# EAGLE design WeatherWidget (EAGLE 9.5.0)
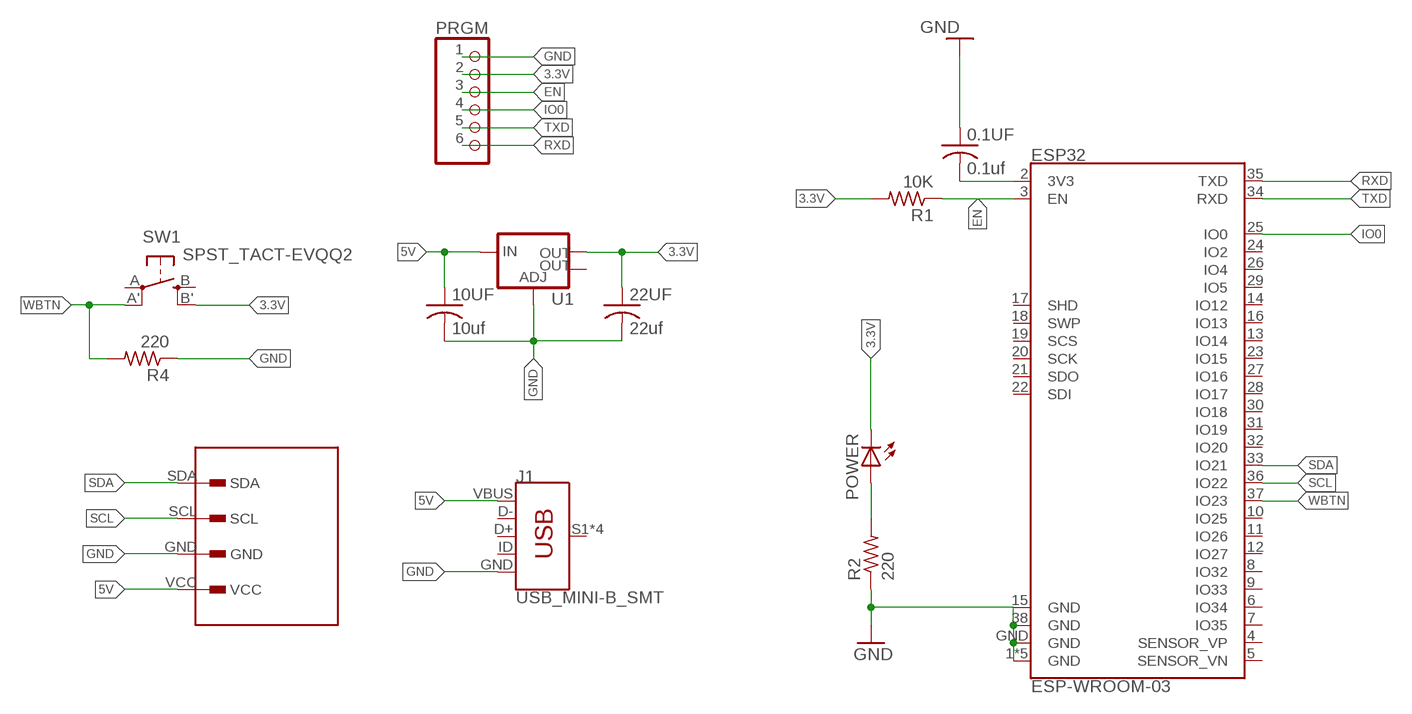
[diagram p0: schematic, sheet 1]

## Parts
0.1UF  0.1uf  C-USC0805K  [C0805K]
10UF  10uf  C-USC0805K  [C0805K]
22UF  22uf  C-USC0805K  [C0805K]
128X1  128X64OLED  [128X64OLED]
ESP32  ESP-WROOM-03  [ESP-WROOM-03-HOLES]
J1  USB_MINI-B_SMT  [USB-MINIB]
POWER  LEDCHIP-LED0805  [CHIP-LED0805]
PRGM  PINHD-1X6  [1X06]
R1  10K  R-US_R0805  [R0805]
R2  220  R-US_R0805  [R0805]
R4  220  R-US_R0805  [R0805]
SW1  SPST_TACT-EVQQ2  [EVQ-Q2]
U1  V_REG_LM1117SOT223  [SOT223]

## Nets
3.3V: 22UF.1 POWER.C PRGM.2 R1.2 SW1.B'(S1) U1.2(OUT)
5V: 10UF.1 128X1.VCC J1.VBUS U1.3(IN)
EN: ESP32.3(EN) PRGM.3 R1.1
GND: 0.1UF.1 10UF.2 22UF.2 128X1.GND ESP32.1(GND) ESP32.15(GND) ESP32.38(GND) ESP32.GND ESP32.GND1(GND) ESP32.GND2(GND) ESP32.GND3(GND) ESP32.GND4(GND) J1.GND PRGM.1 R2.1 R4.1 U1.1(ADJ)
IO0: ESP32.25(IO0) PRGM.4
N$1: POWER.A R2.2
N$2: 0.1UF.2 ESP32.2(3V3)
RXD: ESP32.35(TXD) PRGM.6
SCL: 128X1.SCL ESP32.36(IO22)
SDA: 128X1.SDA ESP32.33(IO21)
TXD: ESP32.34(RXD) PRGM.5
WBTN: ESP32.37(IO23) R4.2 SW1.A'(P1)
Unconnected: ESP32.4(SENSOR_VP) ESP32.5(SENSOR_VN) ESP32.6(IO34) ESP32.7(IO35) ESP32.8(IO32) ESP32.9(IO33) ESP32.10(IO25) ESP32.11(IO26) ESP32.12(IO27) ESP32.13(IO14) ESP32.14(IO12) ESP32.16(IO13) ESP32.17(SHD) ESP32.18(SWP) ESP32.19(SCS) ESP32.20(SCK) ESP32.21(SDO) ESP32.22(SDI) ESP32.23(IO15) ESP32.24(IO2) ESP32.26(IO4) ESP32.27(IO16) ESP32.28(IO17) ESP32.29(IO5) ESP32.30(IO18) ESP32.31(IO19) ESP32.32(IO20) J1.D+ J1.D- J1.ID J1.S1(SHIELD) J1.S2(SHIELD) J1.S3(SHIELD) J1.S4(SHIELD) SW1.A(P) SW1.B(S) U1.4(OUT)

## Library data of the parts
0.1UF 10UF 22UF = adafruit:C-US: CAPACITOR, American symbol
128X1 = 128x64oled:128X64OLED
ESP32 = bitcows-esp32:ESP-WROOM-03
J1 = SparkFun-Connectors:USB_MINI-B: USB type Mini-B Connector Breaks out 5th pin, and includes shield pins if needed. SparkFun Products: SparkFun FTDI Basic Breakout <https://www.sparkfun.com/products/9716> SparkFun XBee Explorer USB <https://www.sparkfun.com/products/11812> SparkFun Redboard <https://www.sparkfun.com/products/12757>; PROD_ID: CONN-08193; SF_ID: PRT-00587
POWER = adafruit:LED: LED OSRAM: - CHIPLED LG R971, LG N971, LY N971, LG Q971, LY Q971, LO R971, LY R971 LH N974, LH R974 LS Q976, LO Q976, LY Q976 LO Q996 - Hyper CHIPLED LW Q18S LB Q993, LB Q99A, LB R99A - SideLED LS A670, LO A670, LY A670, LG A670, LP A670 LB A673, LV A673, LT A673, LW A673 LH A674 LY A675 LS A676, LA A676, LO A676, LY A676, LW A676 LS A679, LY A679, LG A679 - Hyper Micro SIDELED® LS Y876, LA Y876, LO Y876, LY Y876 LT Y87S - SmartLED LW L88C, LW L88S LB L89C, LB L89S, LG L890 LS L89K, LO L89K, LY L89K LS L896, LA L896, LO L896, LY L896 - TOPLED LS T670, LO T670, LY T670, LG T670, LP T670 LSG T670, LSP T670, LSY T670, LOP T670, LYG T670 LG T671, LOG T671, LSG T671 LB T673, LV T673, LT T673, LW T673 LH T674 LS T676, LA T676, LO T676, LY T676, LB T676, LH T676, LSB T676, LW T676 LB T67C, LV T67C, LT T67C, LS T67K, LO T67K, LY T67K, LW E67C LS E67B, LA E67B, LO E67B, LY E67B, LB E67C, LV E67C, LT E67C LW T67C LS T679, LY T679, LG T679 LS T770, LO T770, LY T770, LG T770, LP T770 LB T773, LV T773, LT T773, LW T773 LH T774 LS E675, LA E675, LY E675, LS T675 LS T776, LA T776, LO T776, LY T776, LB T776 LHGB T686 LT T68C, LB T68C - Hyper Mini TOPLED® LB M676 - Mini TOPLED Santana® LG M470 LS M47K, LO M47K, LY M47K Source: http://www.osram.convergy.de/
PRGM = adafruit:PINHD-1X6: PIN HEADER
R1 R2 R4 = adafruit:R-US_: RESISTOR, American symbol
SW1 = adafruit:SPST_TACT: SMT 6mm switch, EVQQ2 series http://www.ladyada.net/library/eagle
U1 = SparkFun-IC-Power:V_REG_LM1117: Voltage Regulator LM1117 Standard adjustable voltage regulator but in SMD form. Spark Fun Electronics SKU : COM-00595; PROD_ID: VREG-08170

## Board
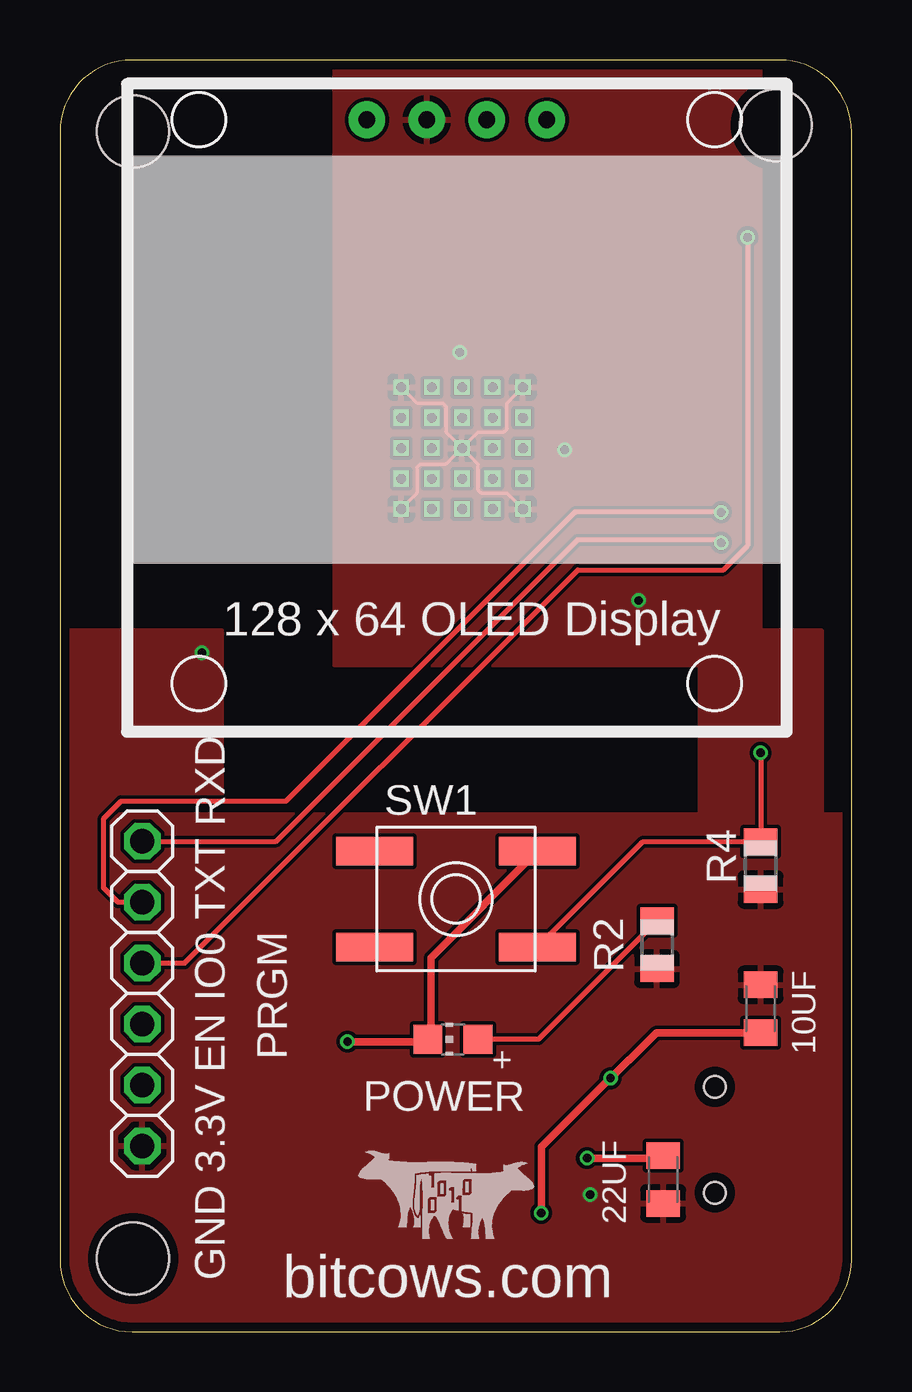
[diagram p1: board, top side]
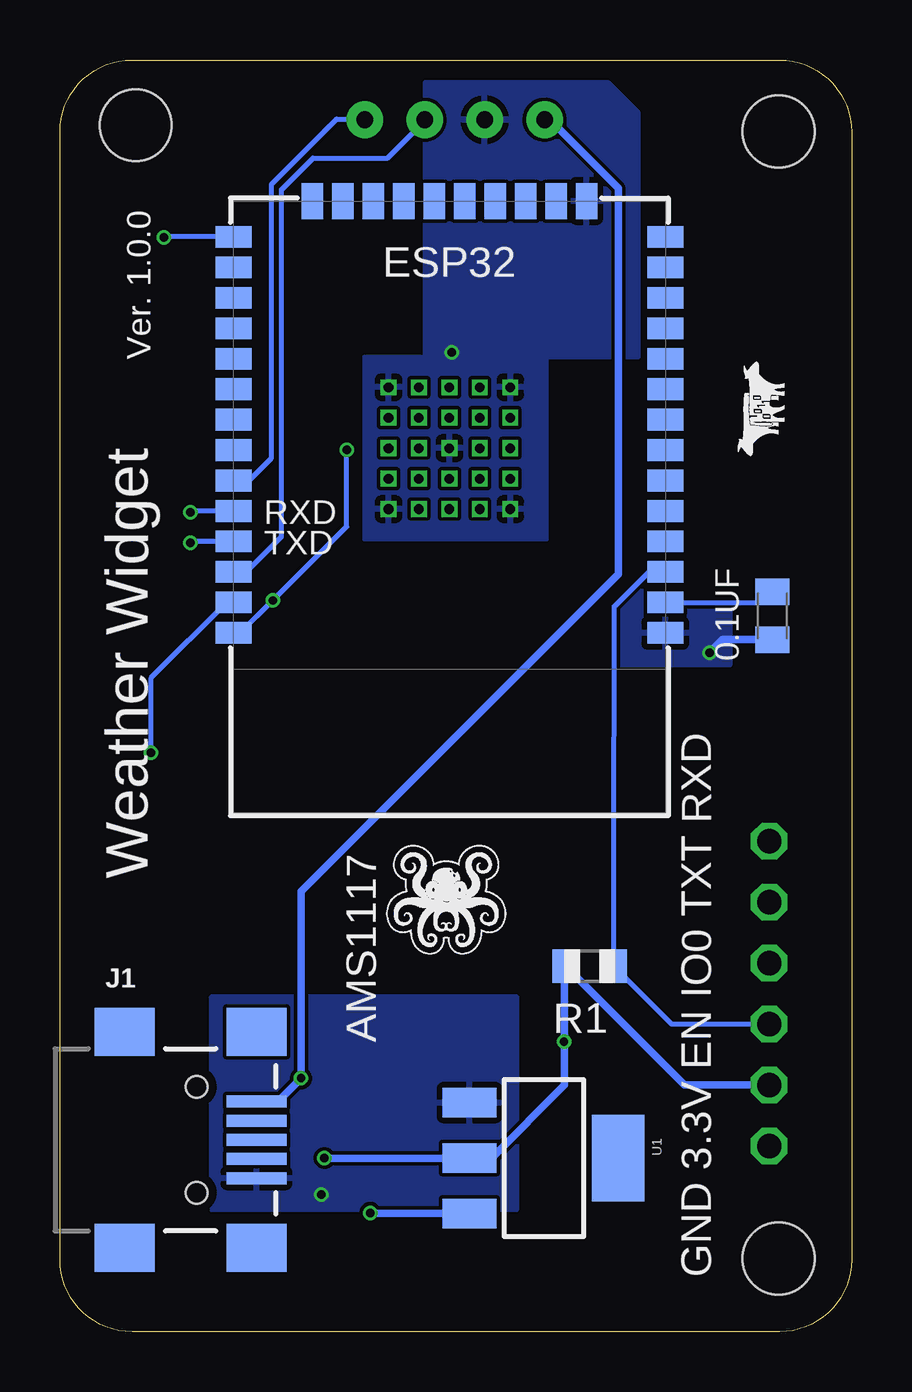
[diagram p2: board, bottom side, seen from below]

Size 33 x 53.01 mm. Coordinates in mm from the lower left corner, seen from the top.
Outline: 33,3 33,50.01 arc90 30,53.01 3,53.01 arc90 0,50.01 0,3 arc90 3,0 30,0 arc90 33,3
Copper layers (1*16): Top 0.035559375mm / dielectric 1.6mm / Bottom 0.035559375mm
Design rules "oshpark-2layer": minimum track width 6mil, minimum drill 10mil, track to track 6mil, track to pad 6mil, pad to pad 6mil, via to via 6mil, smd to smd 6mil, copper to edge 15mil, drill to drill 6mil, minimum pad ring 5mil, minimum via ring 5mil, stop-mask expansion 2.5mil, vias tented up to drill 0mil, thermal gap 10mil
Holes 3 mm at 3.05,50.04 29.84,50.29 3.05,3.05

### Footprints (pad centres in the part's own frame; a part is rotated, then mirrored left to right if it is on the bottom)
C0805K = smd 1.1 x 1.4: 1 -1,0; 2 1,0
128X64OLED = drill 0.7 pad 1.524: GND 12.5,25.5; SCL 15,25.5; SDA 17.5,25.5; VCC 10,25.5
ESP-WROOM-03-HOLES = smd 0.9 x 1.5: 1 7.7,9; 2 6.43,9; 3 5.16,9; 4 3.89,9; 5 2.62,9; 6 1.35,9; 7 0.08,9; 8 -1.19,9; 9 -2.46,9; 10 -3.73,9; 11 -5,9; 12 -6.27,9; 13 -7.54,9; 14 -8.81,9; 25 -8.81,-9; 26 -7.54,-9; 27 -6.27,-9; 28 -5,-9; 29 -3.73,-9; 30 -2.46,-9; 31 -1.19,-9; 32 0.08,-9; 33 1.35,-9; 34 2.62,-9; 35 3.89,-9; 36 5.16,-9; 37 6.43,-9; 38 7.7,-9 | smd 1.5 x 0.9: 15 -10.3,5.715; 16 -10.3,4.445; 17 -10.3,3.175; 18 -10.3,1.905; 19 -10.3,0.635; 20 -10.3,-0.635; 21 -10.3,-1.905; 22 -10.3,-3.175; 23 -10.3,-4.445; 24 -10.3,-5.715 | drill 0.4 square: GND -2.54,2.54; GND1 2.54,2.54; GND2 0,0; GND3 -2.54,-2.54; GND4 2.54,-2.54; P$2 -2.54,1.27; P$4 -2.54,-1.27; P$5 -2.54,0; P$8 2.54,-1.27; P$9 2.54,1.27; P$10 0,2.54; P$11 -1.27,2.54; P$12 2.54,0; P$13 1.27,2.54; P$14 1.27,-2.54; P$15 0,-2.54; P$16 -1.27,-2.54; P$17 -1.27,-1.27; P$18 -1.27,0; P$19 -1.27,1.27; P$20 0,1.27; P$21 1.27,1.27; P$22 1.27,0; P$24 0,-1.27; P$25 1.27,-1.27
USB-MINIB = smd 2.5 x 0.5: D+ 2.5,0; D- 2.5,0.8; GND 2.5,-1.6; ID 2.5,-0.8; VBUS 2.5,1.6 | smd 2.5 x 2: S1 -3,4.5; S2 2.5,4.5; S3 -3,-4.5; S4 2.5,-4.5 | hole 0.9: 0,2.2; 0,-2.2
CHIP-LED0805 = smd 1.2 x 1.2: A 0,-1.05; C 0,1.05
1X06 = drill 1.016 octagon: 1 -6.35,0; 2 -3.81,0; 3 -1.27,0; 4 1.27,0; 5 3.81,0; 6 6.35,0
R0805 = smd 1.1 x 1.4: 1 -1,0; 2 1,0
EVQ-Q2 = smd 3.2 x 1.2: A -3.4,-2; A' 3.4,-2; B -3.4,2; B' 3.4,2
SOT223 = smd 1.219 x 2.235: 1 -2.311,-3.099; 2 0,-3.099; 3 2.311,-3.099 | smd 3.6 x 2.2: 4 0,3.099

### Placement (x,y rotation side)
0.1UF  3.3,29.84 90 bottom
10UF  29.21,13.46 90 top
22UF  25.15,6.35 270 top
128X1  2.79,25.02 0 top
ESP32  16.76,36.83 270 bottom
J1  27.3,8 0 bottom
POWER  16.38,12.19 90 top
PRGM  3.43,14.1 90 top
R1  10.92,15.24 180 bottom
R2  24.89,16.13 90 top
R4  29.21,19.43 90 top
SW1  16.51,18.03 0 top
U1  12.83,7.24 270 bottom
U$1  [BITCOWS_SM]  2.67,36.45 90 bottom
U$2  [BITCOWS]  12.32,3.64 0 top
U$3  [SFE_LUDUS-S]  16.89,17.65 0 bottom

### Tracks (layer width: path | path; a pad name or v marks a point on that pad's centre or on a via)
3.3V  (via drill 0.35)
  Top 0.203: 11.99,12.08 v11.99,12.09 | v21.97,7.24 21.99,7.22 | 22UF.1 25.02,7.22
  Top 0.305: 11.99,12.08 15.22,12.08 POWER.C 15.46,12.32 15.46,15.58 SW1.B' | 25.02,7.22 21.99,7.22
  Bottom 0.305: PRGM.2 6.97,10.29 R1.2 11.96,15.2 11.96,12.12 v11.99,12.09 11.96,12.06 11.96,10.29 15.01,7.24 U1.2 v21.97,7.24
5V  (via drill 0.35)
  Top 0.305: v20.07,4.95 20.07,7.71 22.92,10.57 v22.95,10.57 23.71,11.33 23.71,11.32 24.86,12.46 10UF.1
  Bottom 0.203: 19.91,4.93 19.94,4.95 v20.07,4.95
  Bottom 0.305: U1.3 19.91,4.93 | 128X1.VCC 12.58,50.52 9.72,47.66 9.72,31.59 22.95,18.35 v22.95,10.57 23.74,9.77 23.91,9.6 J1.VBUS
EN
  Bottom 0.203: PRGM.3 7.51,12.83 R1.1 9.92,19.41 9.9,30.21 8.45,31.67 ESP32.3
GND  (via drill 0.35)
  Top 0.152: ESP32.GND1 14.89,34.95 14.89,36.03 15.02,36.17 16.1,36.17 ESP32.GND2 | ESP32.GND 14.89,38.71 15.97,38.71 16.1,38.57 16.1,37.49 ESP32.GND2 | ESP32.GND3 18.64,38.71 18.64,37.63 18.51,37.49 17.43,37.49 ESP32.GND2 | ESP32.GND4 18.64,34.95 17.56,34.95 17.43,35.09 17.43,36.17 ESP32.GND2
  Bottom 0.203: v21.04,36.77 21.04,33.56 24.76,29.84 | v24.13,30.48 24.76,29.85 24.76,29.84 | 24.76,29.84 25.48,29.13 ESP32.38
  Bottom 0.305: 0.1UF.1 5.38,28.84 v5.92,28.31
  other vias: 22.1,5.71 16.66,40.83
  pour Top: -2.54,21.59 34.29,21.59 34.29,-1.27 -2.54,-1.27
  pour Top: 11.43,53.34 11.43,27.76 29.21,27.76 29.21,53.34
  pour Bottom: 12.7,40.64 20.32,40.64 20.32,33.02 12.7,33.02
  pour Bottom: 13.97,13.97 13.97,5.08 26.67,5.08 26.67,13.97
  pour Top: 26.67,27.94 26.67,17.78 31.75,17.78 31.75,29.21 26.67,29.21
  pour Bottom: 10.16,52.07 17.78,52.07 17.78,40.64 8.89,40.64 8.89,50.8
  pour Bottom: 5.08,33.02 5.08,27.79 13.97,27.79 13.97,33.02
  pour Top: 6.74,20.32 6.74,29.21 0,29.21 0,20.32
IO0  (via drill 0.35)
  Top 0.203: PRGM.4 5.21,15.37 21.59,31.75 27.65,31.75 28.68,32.78 28.68,45.61 v28.66,45.62
  Bottom 0.203: v28.66,45.62 28.64,45.64 ESP32.25
N$1
  Top 0.203: R2.2 19.95,12.19 POWER.A
N$2
  Bottom 0.203: ESP32.2 3.75,30.4 0.1UF.2
RXD  (via drill 0.35)
  Top 0.203: PRGM.6 9.02,20.45 21.59,33.02 27.43,33.02 v27.56,32.89
  Bottom 0.203: ESP32.35 27.51,32.94 v27.56,32.89
SCL
  Bottom 0.203: ESP32.36 25.23,31.67 23.76,33.14 23.76,47.61 22.45,48.92 19.34,48.92 17.79,50.47 128X1.SCL
SDA
  Bottom 0.203: 128X1.SDA 20.32,50.55 21.46,50.55 24.19,47.82 24.19,36.4 25.12,35.48 ESP32.33
TXD  (via drill 0.35)
  Top 0.203: v27.56,34.16 21.46,34.16 9.41,22.11 2.54,22.11 1.8,21.37 1.8,18.52 2.41,17.91 PRGM.5
  Bottom 0.203: ESP32.34 27.51,34.21 v27.56,34.16
WBTN  (via drill 0.35)
  Top 0.203: SW1.A' 24.31,20.43 R4.2 v29.21,24.13
  Bottom 0.203: ESP32.37 26.05,30.4 29.21,27.24 v29.21,24.13

### Text on the board
tNames: GND 3.3V EN IO0 TXT RXD | bitcows.com
bNames: Ver. 1.0.0 | Weather Widget | RXD | TXD | AMS1117 | GND 3.3V EN IO0 TXT RXD